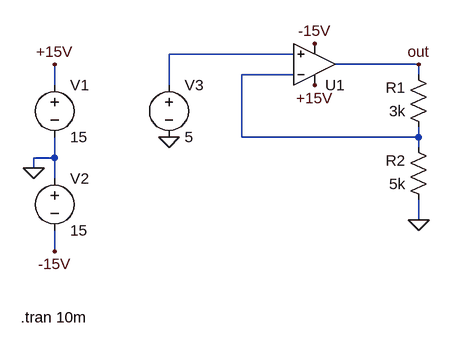
[diagram p0: schematic sim_b.asc]
sim_b.asc, the LTspice schematic file:
Version 4
SHEET 1 880 680
WIRE 112 -64 -80 -64
WIRE 304 -48 176 -48
WIRE 112 -32 32 -32
WIRE 304 -32 304 -48
WIRE -256 -16 -256 -48
WIRE -80 -16 -80 -64
WIRE 32 64 32 -32
WIRE 304 64 304 48
WIRE 304 64 32 64
WIRE 304 80 304 64
WIRE -256 96 -256 64
WIRE -256 96 -288 96
WIRE -288 112 -288 96
WIRE -256 128 -256 96
WIRE 304 192 304 160
WIRE -256 240 -256 208
FLAG -288 112 0
FLAG -256 -48 +15V
FLAG -256 240 -15V
FLAG 144 -16 +15V
FLAG 144 -80 -15V
FLAG -80 64 0
FLAG 304 192 0
FLAG 304 -48 out
SYMBOL OpAmps\\UniversalOpAmp2 144 -48 M180
SYMATTR InstName U1
SYMBOL voltage -256 -32 R0
WINDOW 123 0 0 Left 0
WINDOW 39 0 0 Left 0
SYMATTR InstName V1
SYMATTR Value 15
SYMBOL voltage -256 112 R0
WINDOW 123 0 0 Left 0
WINDOW 39 0 0 Left 0
SYMATTR InstName V2
SYMATTR Value 15
SYMBOL res 320 64 R180
WINDOW 0 36 76 Left 2
WINDOW 3 36 40 Left 2
SYMATTR InstName R1
SYMATTR Value 3k
SYMBOL voltage -80 -32 R0
WINDOW 123 0 0 Left 0
WINDOW 39 0 0 Left 0
SYMATTR InstName V3
SYMATTR Value 5
SYMBOL res 320 176 R180
WINDOW 0 36 76 Left 2
WINDOW 3 36 40 Left 2
SYMATTR InstName R2
SYMATTR Value 5k
TEXT -308 342 Left 2 !.tran 10m

The netlist it stands for:
* sim_b.asc
XU1 N001 N002 +15V -15V out level2 Avol=1Meg GBW=10Meg Slew=10Meg Ilimit=25m Rail=0 Vos=0 En=0 Enk=0 In=0 Ink=0 Rin=500Meg  ; pins In+ In- V+ V- OUT
V1 +15V 0 15
V2 0 -15V 15
R1 N002 out 3k
V3 N001 0 5
R2 0 N002 5k
.tran 10m
.lib UniversalOpAmp2.lib
.backanno
.end